# EAGLE schematic arduino_to_ds3231 (EAGLE 9.2.2)
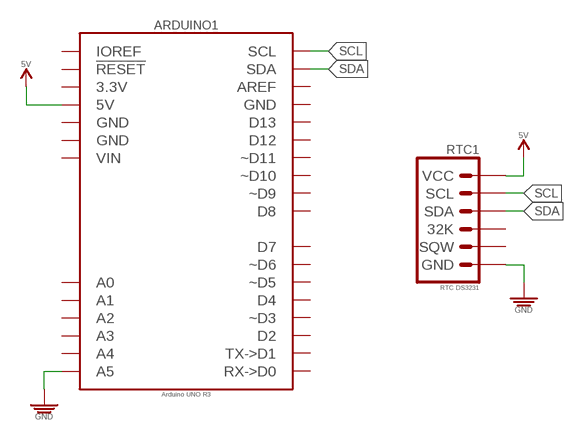
[diagram p0: schematic, sheet 1]

## Parts
ARDUINO1  Arduino UNO R3  ARDUINO_UNO_R3_NO-HOLES_NO-AVR-ISP  [ARDUINO_UNO_R3_NO-HOLES_NO-AVR-ISP]
RTC1  RTC DS3231  RTC_DS3231_PTH_VERT-FEMALE_2.54MM  [CONNECTOR_RTC-DS3231]

## Nets
5V: ARDUINO1.5V RTC1.VCC
GND: ARDUINO1.A5 RTC1.GND
SCL: ARDUINO1.SCL RTC1.SCL
SDA: ARDUINO1.SDA RTC1.SDA
Unconnected: ARDUINO1.3.3V ARDUINO1.A0 ARDUINO1.A1 ARDUINO1.A2 ARDUINO1.A3 ARDUINO1.A4 ARDUINO1.AREF ARDUINO1.D0(RX->D0) ARDUINO1.D1(TX->D1) ARDUINO1.D2 ARDUINO1.D3(~D3) ARDUINO1.D4 ARDUINO1.D5(~D5) ARDUINO1.D6(~D6) ARDUINO1.D7 ARDUINO1.D8 ARDUINO1.D9(~D9) ARDUINO1.D10(~D10) ARDUINO1.D11(~D11) ARDUINO1.D12 ARDUINO1.D13 ARDUINO1.GND@1(GND) ARDUINO1.GND@2(GND) ARDUINO1.GND@3(GND) ARDUINO1.IOREF ARDUINO1.RESET@1(!RESET) ARDUINO1.VIN RTC1.32K RTC1.SQW

## Library data of the parts
ARDUINO1 = PiB_boards:ARDUINO_UNO_R3_NO-HOLES_NO-AVR-ISP; DATASHEET: https://media.digikey.com/pdf/Data%20Sheets/Arduino%20PDFs/A000066_Web.pdf; DATASHEET_CABLE: http://www.assmann-wsw.com/fileadmin/datasheets/ASS_7066_CA.pdf; DIST: Digikey; DISTLINK: https://www.digikey.com/products/en?keywords=1050-1024-ND; DISTLINK_CABLE: https://www.digikey.com/products/en?keywords=AE1462-ND; DISTPN: 1050-1024-ND; DISTPN_CABLE: AE1462-ND; DIST_CABLE: Digikey; MFR: Arduino; MFR_CABLE: Assmann WSW Components; MPN: A000066; MPN_CABLE: AK672/2-1
RTC1 = PiB:RTC_DS3231; DATASHEET: https://datasheets.maximintegrated.com/en/ds/DS3231.pdf; DATASHEET_CONNECTOR: xPxCyyyLFBN-RC Drawing; DIST: Amazon; DISTLINK: https://www.amazon.com/Donop-DS3231-AT24C32-precision-Arduino/dp/B00HCB7VYS; DISTLINK_CONNECTOR: https://www.digikey.com/products/en?keywords=PPTC061LFBN-RC; DISTPN: B00HCB7VYS; DISTPN_CONNECTOR: S7004-ND; DIST_CONNECTOR: Digikey; MFR: Eztronics Corp; MFR_CONNECTOR: Sullins Connector Solutions; MPN: DS3231; MPN_CONNECTOR: PPTC061LFBN-RC